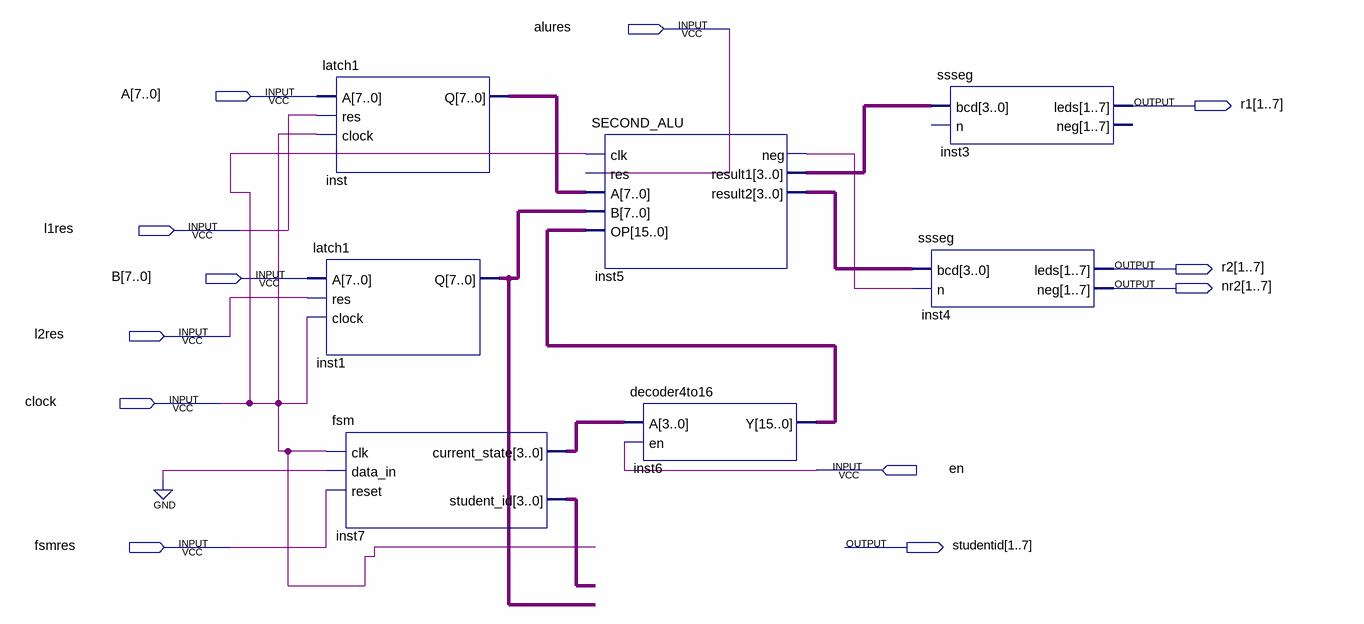
[diagram p0: schematic sheet]
// Quartus schematic fullVER1.bdf as structural Verilog: 7 symbols, 12 pins
module fullVER1 (
  input  alures,
  input  [7:0] A,
  input  l1res,
  input  [7:0] B,
  input  l2res,
  input  clock,
  input  en,
  input  fsmres,
  output [1:7] r1,
  output [1:7] r2,
  output [1:7] nr2,
  output [1:7] studentid
);

  wire inst5_neg;
  wire [3:0] inst5_result1, inst5_result2, inst7_current_state, inst7_student_id;
  wire [7:0] inst1_q, inst_q;
  wire [15:0] inst6_y;

  latch1 inst (.A(A), .res(l1res), .clock(clock), .Q(inst_q));
  latch1 inst1 (.A(B), .res(l2res), .clock(clock), .Q(inst1_q));
  fsm inst7 (
    .clk(clock), .data_in(1'b0), .reset(fsmres), .student_id(inst7_student_id),
    .current_state(inst7_current_state));
  SECOND_ALU inst5 (
    .clk(clock), .res(alures), .A(inst_q), .B(inst1_q), .OP(inst6_y), .neg(inst5_neg),
    .result1(inst5_result1), .result2(inst5_result2));
  decoder4to16 inst6 (.A(inst7_current_state), .en(en), .Y(inst6_y));
  ssseg inst3 (.bcd(inst5_result1), .leds(r1));  // open: n, neg
  ssseg inst4 (.bcd(inst5_result2), .n(inst5_neg), .leds(r2), .neg(nr2));
endmodule
